# Altium schematic sheet PWR_TPS65295.SchDoc
size A3
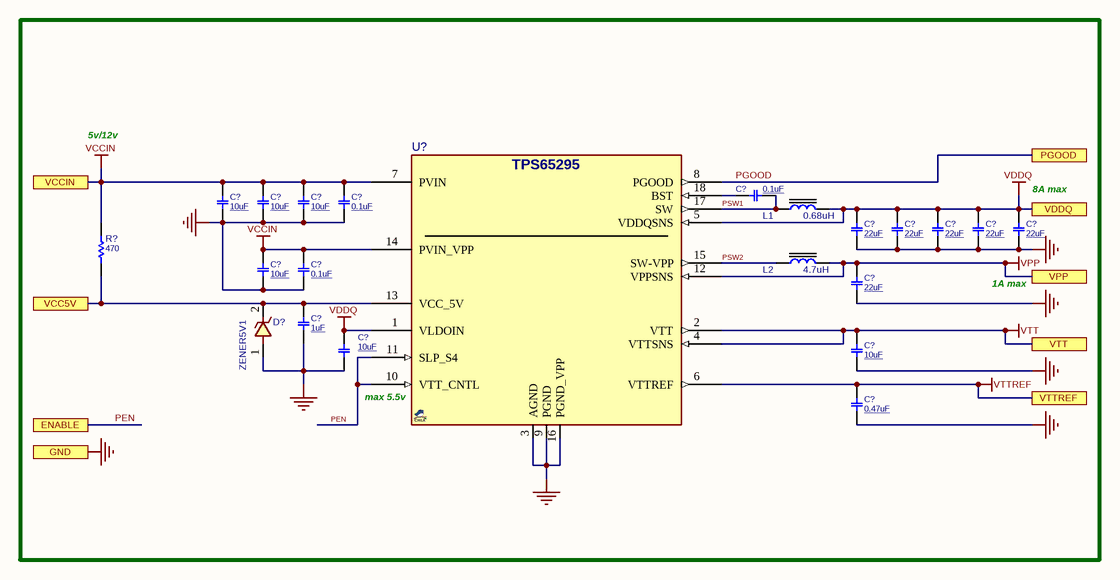
[diagram p0: PWR_TPS65295.SchDoc]

## Parts
(Parts that share a designator on the sheet are numbered #1, #2 ... from top to bottom, then left to right.)
C?#1  10uF  [C0805]
C?#2  10uF  [C0805]
C?#3  10uF  [C0805]
C?#4  0.1uF  [C0402]
C?#5  0.1uF  [C0402]
C?#6  22uF  [C0603]
C?#7  22uF  [C0603]
C?#8  22uF  [C0603]
C?#9  22uF  [C0603]
C?#10  22uF  [C0603]
C?#11  10uF  [C0805]
C?#12  0.1uF  [C0402]
C?#13  22uF  [C0603]
C?#14  1uF  [C0402]
C?#15  10uF  [C0402]
C?#16  10uF  [C0402]
C?#17  0.47uF  [C0402]
D?  ZENER5V1  [D_SOD523]
L1  0.68uH  [L_4]
L2  4.7uH  [L1210]
R?  470  [R0603]
U?  TPS65295  [QFN50_18_RJE]  (value not drawn)

## Ports
ENABLE, GND, PGOOD, VCC5V, VCCIN, VDDQ, VPP, VTT, VTTREF

## Nets
GND: C?#1.2 C?#2.2 C?#3.2 C?#5.1 C?#6.2 C?#7.2 C?#8.2 C?#9.2 C?#10.2 C?#11.2 C?#12.1 C?#13.2 C?#14.2 C?#15.2 C?#16.2 C?#17.2 D?.1 U?.3(AGND) U?.9(PGND) U?.16(PGND_VPP) ; port GND
VCCIN: C?#1.1 C?#2.1 C?#3.1 C?#5.2 C?#11.1 C?#12.2 R?.2 U?.7(PVIN) U?.14(PVIN_VPP) ; port VCCIN
VDDQ: C?#6.1 C?#7.1 C?#8.1 C?#9.1 C?#10.1 C?#15.1 L1.2 U?.1(VLDOIN) U?.5(VDDQSNS) ; port VDDQ
VPP: C?#13.1 L2.2 U?.12(VPPSNS) ; port VPP
VTT: C?#16.1 U?.2(VTT) U?.4(VTTSNS) ; port VTT
VTTREF: C?#17.1 U?.6(VTTREF) ; port VTTREF
PEN: U?.10(VTT_CNTL) U?.11(SLP_S4) ; port ENABLE
PGOOD: U?.8(PGOOD) ; port PGOOD
PSW1: C?#4.2 L1.1 U?.17(SW)
PSW2: L2.1 U?.15(SW-VPP)
VCC5V: C?#14.1 D?.2 R?.1 U?.13(VCC_5V) ; port VCC5V
NetC?#4_1: C?#4.1 U?.18(BST)

## Notes on the sheet
- 5v/12v
- (near C?#10) 8A max
- (near C?#10) 1A max
- (near U?) max 5.5v

## Library data of the parts
C?#1-C?#3 C?#11 = CAP_SMD_MLCC: CAP, MLCC; PARAM: X5R, 20%; PARAM2: 25v; PRICE: 100= 1$; DESC: CAP, MLCC; MANF_P#: -; MANF: -; ASSEMBLY: ASSEMBLY; VALUE: 10uF
C?#4 C?#5 C?#12 = CAP_SMD_MLCC: CAP, MLCC; PARAM2: 50v; PARAM: -; PRICE: 100= 1$; DESC: CAP, MLCC; MANF_P#: -; MANF: -; ASSEMBLY: ASSEMBLY; VALUE: 0.1uF
C?#6-C?#10 C?#13 = CAP_SMD_MLCC: CAP, MLCC; PARAM: X5R, 20%; MANF_P#: LMK107BBJ226MA-T; PARAM2: 10v; PRICE: 100= 1$; DESC: CAP, MLCC; MANF: -; ASSEMBLY: ASSEMBLY; VALUE: 22uF
C?#14 = CAP_SMD_MLCC: CAP, MLCC; PARAM: X5R, 20%; MANF_P#: CC0402KRX5R6BB105; PARAM2: 10v; PRICE: 100= 1$; DESC: CAP, MLCC; MANF: -; ASSEMBLY: ASSEMBLY; VALUE: 1uF
C?#15 C?#16 = CAP_SMD_MLCC: CAP, MLCC; PARAM: X5R, 20%; PARAM2: 6.3v; PRICE: 100= 1$; DESC: CAP, MLCC; MANF_P#: -; MANF: -; ASSEMBLY: ASSEMBLY; VALUE: 10uF
C?#17 = CAP_SMD_MLCC: CAP, MLCC; PARAM: X5R, 20%; PARAM2: 50v; PRICE: 100= 1$; DESC: CAP, MLCC; MANF_P#: -; MANF: -; ASSEMBLY: ASSEMBLY; VALUE: 0.47uF
D? = DIODE_SMD_ZENER_TFZVTR5.6B: DIODE, ZENER; MANF: ROHM; DESC: DESCRIPTION; PARAM2: 5.1V; PARAM: 0.2W, 60Ohm, -55~150oC; MANF_P#: BZT52C5V1T, BZX584C5V1; ASSEMBLY: ASSEMBLY; PRICE: 0.3$; VALUE: ZENER5V1
L1 = INDPWR_SMD: INDUCTOR, POWER, SMD; MANF_P#: SRP0420-R68K; PARAM: 10A, 10mDCR; VALUE: 0.68uH
L2 = INDPWR_SMD: INDUCTOR, POWER, SMD; MANF_P#: L1210R4R7MDWIT; VALUE: 4.7uH
R? = RES_SMD: RESISTOR, SMD; PARAM: -W; DESC: DESCRIPTION; DIST#: MOUSER; PARAM2: 1%; MANF_P#: -; MANF: -; ASSEMBLY: ASSEMBLY; PRICE: 100= 0.5$; VALUE: 470
U? = TPS65295_VQFN: PMIC for DDR4, VQFN-18; MANF: Texas Instruments; PARAM: DDR4 power, -40~125°C; PARAM2: 4.5~18VIN; MANF_P#: TPS65295RJE; PRICE: 4$; ASSEMBLY: ASSEMBLY; VALUE: TPS65295